# EasyEDA Pro project My_first_PCB.epro, schematic New Project

## Sheets
1 Sheet_1: Board Name: New Project; Create Date: 2025-05-11; Page Name: Sheet_1; Project Name: PCB_lllast; Schematic Name: New Project; Update Date: 2025-05-11; Add into BOM: yes; Company: Your Company; Convert to PCB: yes; Date: 2025-04-23; Draw By: telescopelight; REV: 1.0; Sheet: 1/1; spicePre: .
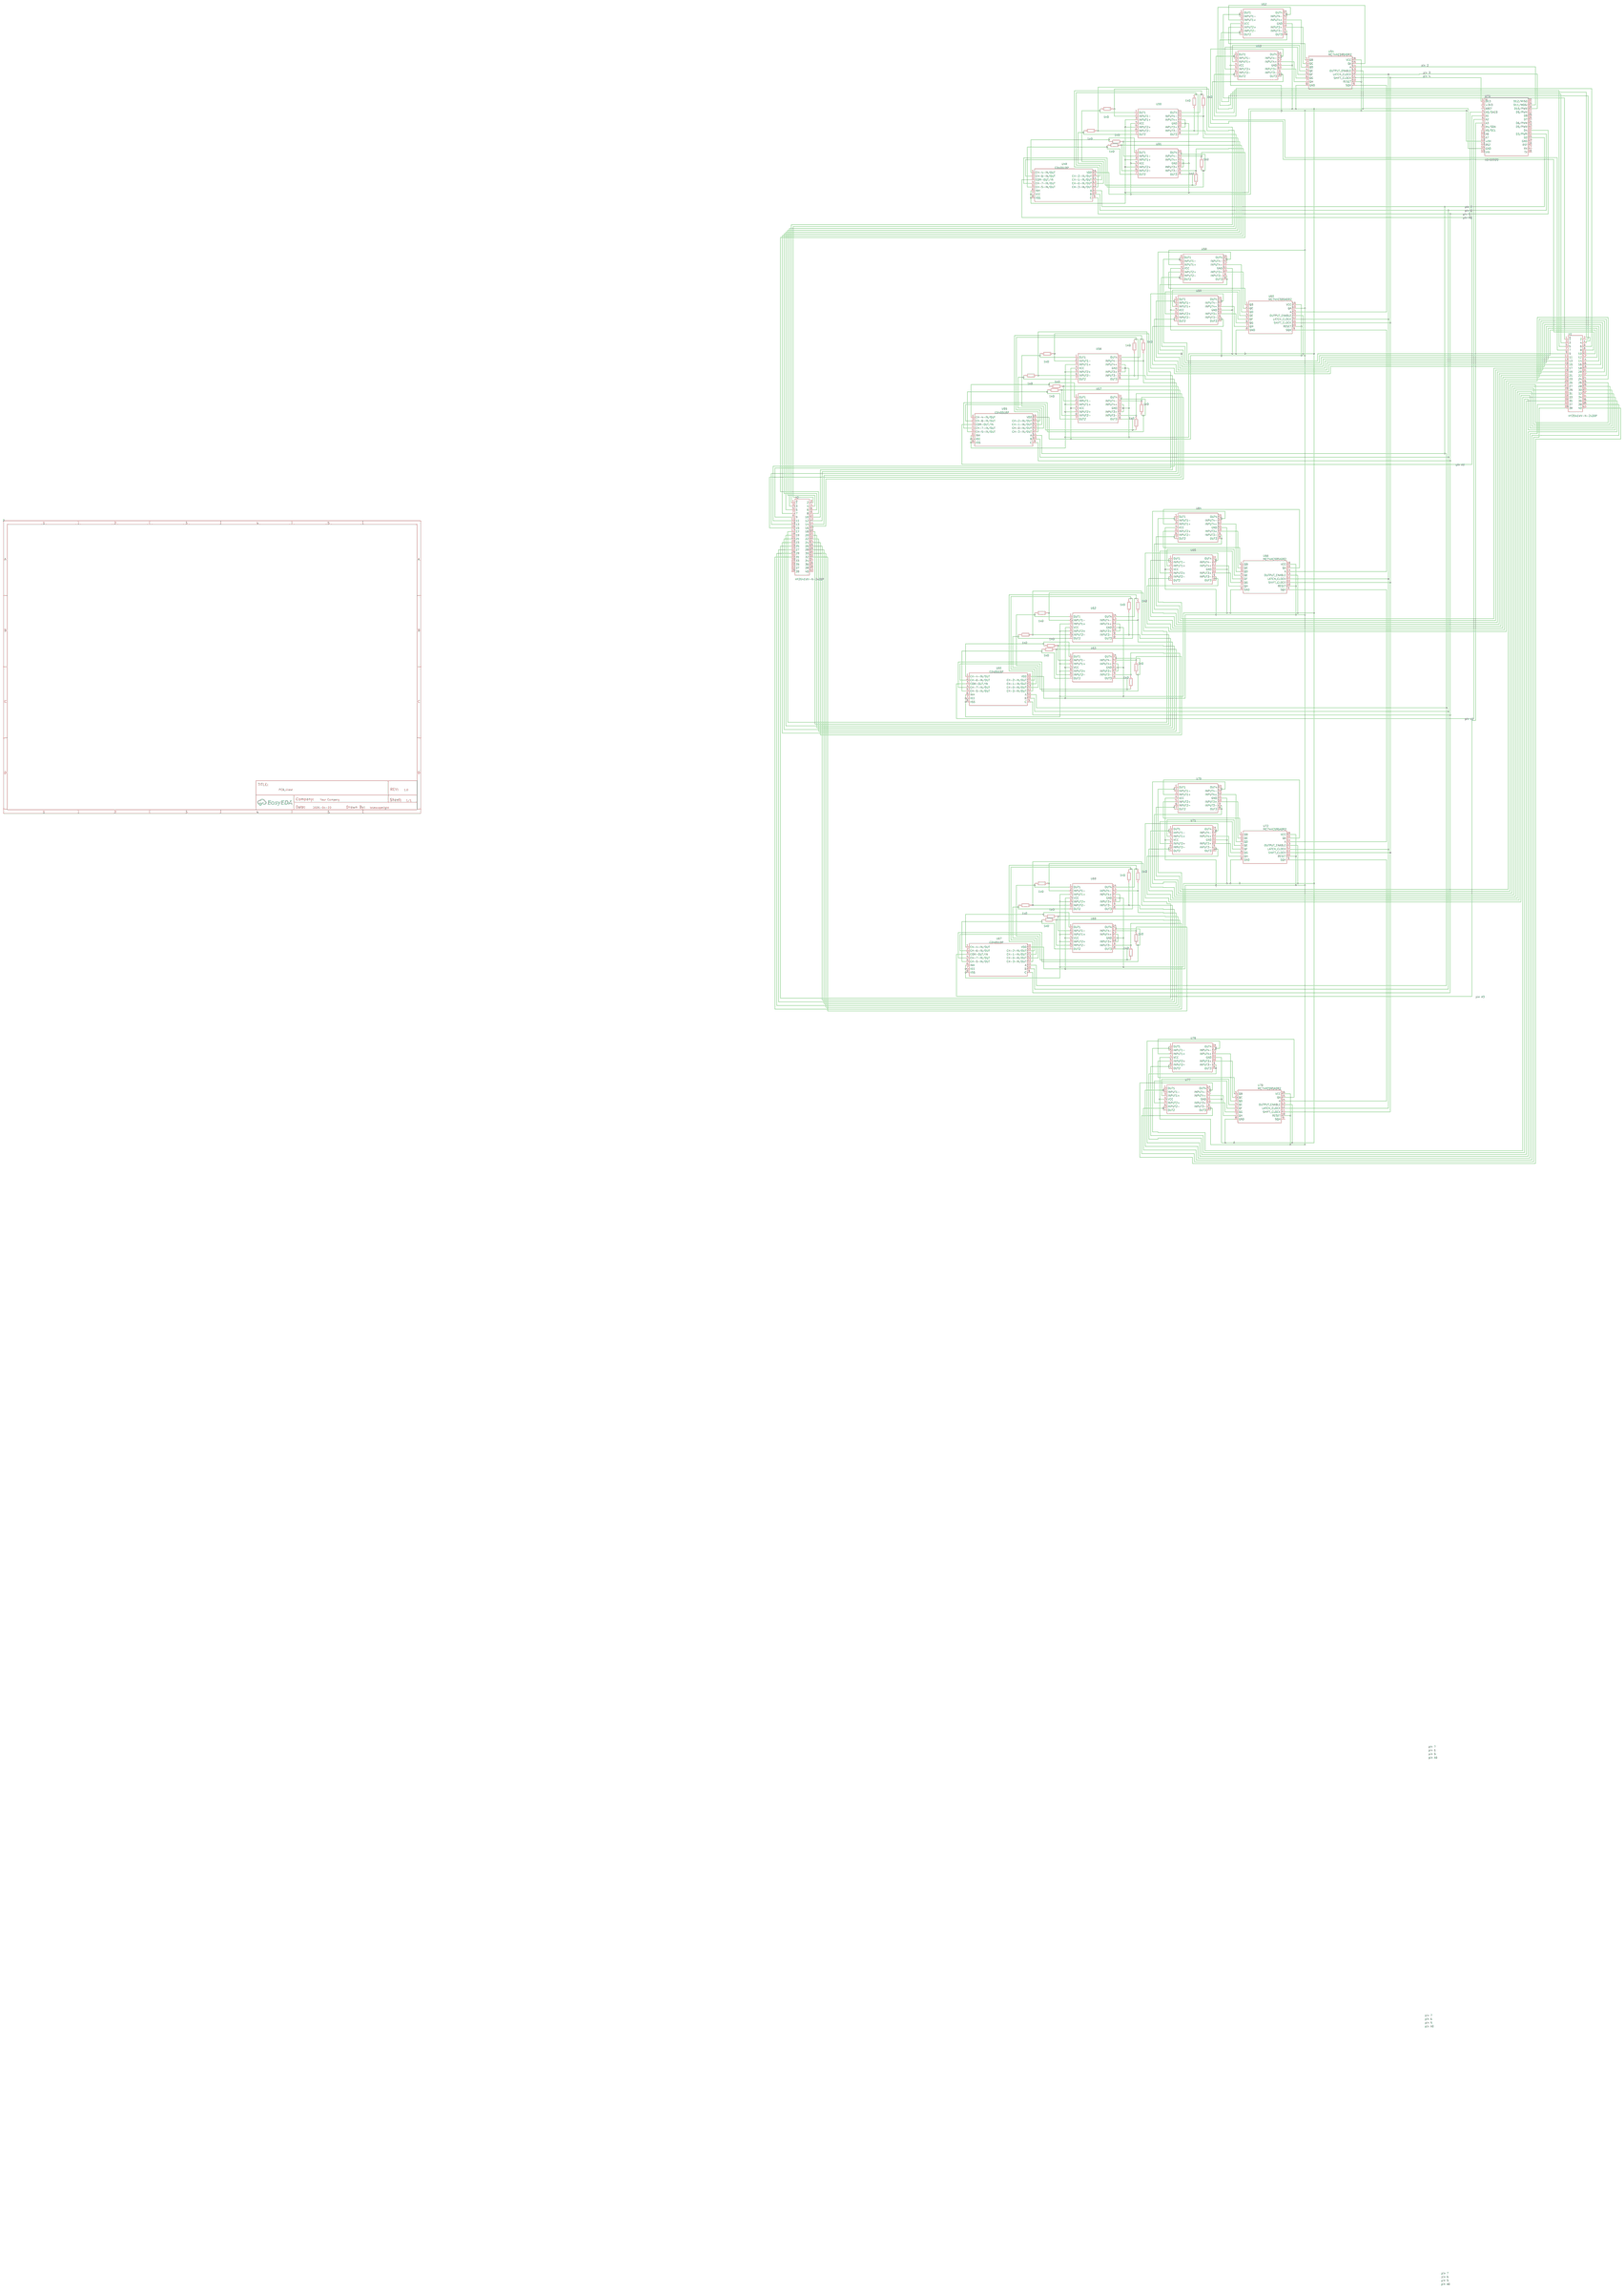
[diagram p0: Sheet_1]
2 P2: Create Date: 2025-04-23; Page Name: P1; Project Name: Project Name; Schematic Name: Schematic Name; Update Date: 2021.11.05; Company: EasyEDA.com; Page Size: A4; Version: V1.0
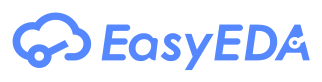
[diagram p1: P2]
3 P3: Create Date: 2025-04-23; Page Name: P1; Project Name: Project Name; Schematic Name: Schematic Name; Update Date: 2021.11.05; Company: EasyEDA.com; Page Size: A4; Version: V1.0
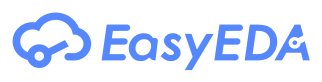
[diagram p2: P3]
4 P4: Create Date: 2025-04-23; Page Name: P1; Project Name: Project Name; Schematic Name: Schematic Name; Update Date: 2021.11.05; Company: EasyEDA.com; Page Size: A4; Version: V1.0
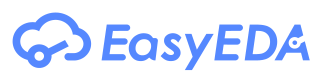
[diagram p3: P4]

## Parts
H1  HY2541WV-N-2x20P  [HDR-TH_40P-P2.54-V-F-R2-C20-S2.54_6]
H2  HY2541WV-N-2x20P  [HDR-TH_40P-P2.54-V-F-R2-C20-S2.54_6]
R65  1kΩ  [R0603]
R66  1kΩ  [R0603]
R67  1kΩ  [R0603]
R68  1kΩ  [R0603]
R69  1kΩ  [R0603]
R70  1kΩ  [R0603]
R71  1kΩ  [R0603]
R72  1kΩ  [R0603]
R73  1kΩ  [R0603]
R74  1kΩ  [R0603]
R75  1kΩ  [R0603]
R76  1kΩ  [R0603]
R77  1kΩ  [R0603]
R78  1kΩ  [R0603]
R79  1kΩ  [R0603]
R80  1kΩ  [R0603]
R81  1kΩ  [R0603]
R82  1kΩ  [R0603]
R83  1kΩ  [R0603]
R84  1kΩ  [R0603]
R85  1kΩ  [R0603]
R86  1kΩ  [R0603]
R87  1kΩ  [R0603]
R88  1kΩ  [R0603]
R89  1kΩ  [R0603]
R90  1kΩ  [R0603]
R91  1kΩ  [R0603]
R92  1kΩ  [R0603]
R93  1kΩ  [R0603]
R94  1kΩ  [R0603]
R95  1kΩ  [R0603]
R96  1kΩ  [R0603]
U49  CD4051BP  [SOIC-16_L9.9-W3.9-P1.27-LS6.0-BL]
U50  LM324N_C20616361  [DIP-14_L19.2-W6.6-P2.54-LS10.9-BL]
U51  LM324N_C20616361  [DIP-14_L19.2-W6.6-P2.54-LS10.9-BL]
U52  LM324N_C20616361  [DIP-14_L19.2-W6.6-P2.54-LS10.9-BL]
U53  LM324N_C20616361  [DIP-14_L19.2-W6.6-P2.54-LS10.9-BL]
U54  MC74HC595ADR2  [SOIC-16_L9.9-W3.9-P1.27-LS6.0-BL]
U55  CD4051BP  [SOIC-16_L9.9-W3.9-P1.27-LS6.0-BL]
U56  LM324N_C20616361  [DIP-14_L19.2-W6.6-P2.54-LS10.9-BL]
U57  LM324N_C20616361  [DIP-14_L19.2-W6.6-P2.54-LS10.9-BL]
U58  LM324N_C20616361  [DIP-14_L19.2-W6.6-P2.54-LS10.9-BL]
U59  LM324N_C20616361  [DIP-14_L19.2-W6.6-P2.54-LS10.9-BL]
U60  MC74HC595ADR2  [SOIC-16_L9.9-W3.9-P1.27-LS6.0-BL]
U61  CD4051BP  [SOIC-16_L9.9-W3.9-P1.27-LS6.0-BL]
U62  LM324N_C20616361  [DIP-14_L19.2-W6.6-P2.54-LS10.9-BL]
U63  LM324N_C20616361  [DIP-14_L19.2-W6.6-P2.54-LS10.9-BL]
U64  LM324N_C20616361  [DIP-14_L19.2-W6.6-P2.54-LS10.9-BL]
U65  LM324N_C20616361  [DIP-14_L19.2-W6.6-P2.54-LS10.9-BL]
U66  MC74HC595ADR2  [SOIC-16_L9.9-W3.9-P1.27-LS6.0-BL]
U67  CD4051BP  [SOIC-16_L9.9-W3.9-P1.27-LS6.0-BL]
U68  LM324N_C20616361  [DIP-14_L19.2-W6.6-P2.54-LS10.9-BL]
U69  LM324N_C20616361  [DIP-14_L19.2-W6.6-P2.54-LS10.9-BL]
U70  LM324N_C20616361  [DIP-14_L19.2-W6.6-P2.54-LS10.9-BL]
U71  LM324N_C20616361  [DIP-14_L19.2-W6.6-P2.54-LS10.9-BL]
U72  MC74HC595ADR2  [SOIC-16_L9.9-W3.9-P1.27-LS6.0-BL]
U76  LM324N_C20616361  [DIP-14_L19.2-W6.6-P2.54-LS10.9-BL]
U77  LM324N_C20616361  [DIP-14_L19.2-W6.6-P2.54-LS10.9-BL]
U78  MC74HC595ADR2  [SOIC-16_L9.9-W3.9-P1.27-LS6.0-BL]
U79  ABX00028  [MOD-TH_ABX00028]

## Library data of the parts
H1 H2 = HY2541WV-N-2x20P: Connector Type:Simple cow constellation Pitch:2.54mm Number of Positions or Pins:2x20P Current Rating:1A Voltage Rating (Max):- Holder Type:Direct Insert Row Spacing:2.54mm Number of Rows:2 Number of PINs Per Row:20 Operating Temperature:-55℃~+105℃ Operat; LCSC Part Name: 2.54mm 2x20P 排数:2 每排P数:20; Supplier Part: C25503130; Manufacturer: HanElectricity(瀚源); Supplier Footprint: 插件,P=2.54mm; JLCPCB Part Class: Extended Part; Datasheet: https://atta.szlcsc.com/upload/public/pdf/source/20240704/F9C642535A626EC3FAD9C1D939CDF554.pdf; Supplier: LCSC; Connector Type: Simple cow constellation; Pitch: 2.54mm; Number of Positions or Pins: 2x20P; Current Rating: 1A; Holder Type: Direct Insert; Row Spacing: 2.54mm; Number of Rows: 2; Number of PINs Per Row: 20; Operating Temperature: -55℃~+105℃
R65-R96 = FRC0603J102 TS: Type:Thick Film Resistors Resistance:1kΩ Tolerance:±5% Tolerance:±5% Power(Watts): Overload Voltage (Max): Temperature Coefficient:±100ppm/℃ Temperature Coefficient:±100ppm/℃ Operating Temperature Range:-55℃~+155℃ Operating Temperature Range:-55℃~+155℃; LCSC Part Name: 1kΩ ±5% 100mW 厚膜电阻; Supplier Part: C2907113; Manufacturer: FOJAN(富捷); Supplier Footprint: 0603; JLCPCB Part Class: Extended Part; Datasheet: https://atta.szlcsc.com/upload/public/pdf/source/20211221/925EC7D7225764EE0046F22065062C87.pdf; Supplier: LCSC; Type: Thick Film Resistors; Tolerance: ±5%; Temperature Coefficient: ±100ppm/℃; Operating Temperature Range: -55℃~+155℃
U49 U55 U61 U67 = CD4051BP: Supplier: LCSC; Supplier Part: C5274825; Manufacturer: Sungine(双竞集成); JLCPCB Part Class: Extended Part; Contributor: lcsc; spicePre: U
U50-U53 U56-U59 U62-U65 U68-U71 U76 U77 = LM324N_C20616361: Supplier: LCSC; Supplier Part: C20616361; Manufacturer: HXY MOSFET(华轩阳电子); Manufacturer Part: LM324N; JLCPCB Part Class: Extended Part; Contributor: lcsc; spicePre: U
U54 U60 U66 U72 U78 = MC74HC595ADR2: Supplier: LCSC; Supplier Part: C3304332; Manufacturer: onsemi(安森美); JLCPCB Part Class: Extended Part; Contributor: lcsc; spicePre: U
U79 = ABX00028: Supplier Part: C21303176; Manufacturer: arduino; Datasheet: https://atta.szlcsc.com/upload/public/pdf/source/20240516/DBE20BC6A27351D8B1B352A6E0678D57.pdf; Supplier: LCSC

## Nets
$1N14304: U54.14(A) U79.29(D11/MOSI)
$1N14310: U52.3(INPUT1+) U54.15(QA)
$1N14316: H1.1 U52.1(OUT1) U52.2(INPUT1-)
$1N14330: H2.8 R67.2 U51.13(INPUT4-)
$1N14338: R67.1 U49.4(CH-7-IN/OUT) U51.14(OUT4)
$1N14350: H2.4 R65.1 U50.13(INPUT4-)
$1N14355: H1.8 U53.13(INPUT4-) U53.14(OUT4)
$1N14369: H1.7 U53.8(OUT3) U53.9(INPUT3-)
$1N14384: H1.5 U53.1(OUT1) U53.2(INPUT1-)
$1N14390: H1.6 U53.6(INPUT2-) U53.7(OUT2)
$1N14396: R69.1 U49.5(CH-5-IN/OUT) U51.7(OUT2)
$1N14405: R68.1 U49.1(CH-4-IN/OUT) U51.1(OUT1)
$1N14418: R66.1 U49.2(CH-6-IN/OUT) U51.8(OUT3)
$1N14427: U49.6(INH) U49.7(VEE) U49.8(VSS) U50.3(INPUT1+) U50.5(INPUT2+) U50.10(INPUT3+) U50.11(GND) U50.12(INPUT4+) U51.3(INPUT1+) U51.5(INPUT2+) U51.10(INPUT3+) U51.11(GND) U51.12(INPUT4+) U52.11(GND) U53.11(GND) U54.8(GND) U54.13(OUTPUT ENABLE) U55.6(INH) U55.7(VEE) U55.8(VSS) U56.3(INPUT1+) U56.5(INPUT2+) U56.10(INPUT3+) U56.11(GND) U56.12(INPUT4+) U57.3(INPUT1+) U57.5(INPUT2+) U57.10(INPUT3+) U57.11(GND) U57.12(INPUT4+) U58.11(GND) U59.11(GND) U60.8(GND) U60.13(OUTPUT ENABLE) U61.6(INH) U61.7(VEE) U61.8(VSS) U62.3(INPUT1+) U62.5(INPUT2+) U62.10(INPUT3+) U62.11(GND) U62.12(INPUT4+) U63.3(INPUT1+) U63.5(INPUT2+) U63.10(INPUT3+) U63.11(GND) U63.12(INPUT4+) U64.11(GND) U65.11(GND) U66.8(GND) U66.13(OUTPUT ENABLE) U67.6(INH) U67.7(VEE) U67.8(VSS) U68.3(INPUT1+) U68.5(INPUT2+) U68.10(INPUT3+) U68.11(GND) U68.12(INPUT4+) U69.3(INPUT1+) U69.5(INPUT2+) U69.10(INPUT3+) U69.11(GND) U69.12(INPUT4+) U70.11(GND) U71.11(GND) U72.8(GND) U72.13(OUTPUT ENABLE) U76.11(GND) U77.11(GND) U78.8(GND) U78.13(OUTPUT ENABLE) U79.14(GND)
$1N14475: H2.6 R69.2 U51.6(INPUT2-)
$1N14479: U49.16(VDD) U50.4(VCC) U51.4(VCC) U52.4(VCC) U53.4(VCC) U54.10(RESET) U54.16(VCC) U55.16(VDD) U56.4(VCC) U57.4(VCC) U58.3(INPUT1+) U58.4(VCC) U59.4(VCC) U60.10(RESET) U60.15(QA) U60.16(VCC) U61.16(VDD) U62.4(VCC) U63.4(VCC) U64.4(VCC) U65.4(VCC) U66.10(RESET) U66.16(VCC) U67.16(VDD) U68.4(VCC) U69.4(VCC) U70.4(VCC) U71.4(VCC) U72.10(RESET) U72.16(VCC) U76.4(VCC) U77.4(VCC) U78.10(RESET) U78.16(VCC) U79.12(+5V)
$1N14502: R70.2 U49.15(CH-2-IN/OUT) U50.8(OUT3)
$1N14513: R65.2 U49.12(CH-3-IN/OUT) U50.14(OUT4)
$1N14524: R71.1 U49.13(CH-0-IN/OUT) U50.1(OUT1)
$1N14533: R72.1 U49.14(CH-1-IN/OUT) U50.7(OUT2)
$1N14552: U49.10(B) U55.10(B) U61.10(B) U67.10(B) U79.21(D3/PWM)
$1N14556: U49.11(A) U55.11(A) U61.11(A) U67.11(A) U79.20(D2)
$1N14560: U49.3(COM-OUT/IN) U79.4(A0/DAC0)
$1N14564: U53.10(INPUT3+) U54.6(QG)
$1N14568: U53.12(INPUT4+) U54.7(QH)
$1N14572: U53.3(INPUT1+) U54.4(QE)
$1N14578: U53.5(INPUT2+) U54.5(QF)
$1N14584: U52.10(INPUT3+) U54.2(QC)
$1N14588: U52.12(INPUT4+) U54.3(QD)
$1N14592: U52.5(INPUT2+) U54.1(QB)
$1N16074: U61.3(COM-OUT/IN) U79.6(A2)
$1N16078: R82.1 U61.2(CH-6-IN/OUT) U63.8(OUT3)
$1N16087: R83.1 U61.4(CH-7-IN/OUT) U63.14(OUT4)
$1N16099: H2.23 R82.2 U63.9(INPUT3-)
$1N16103: H2.24 R83.2 U63.13(INPUT4-)
$1N16107: H2.20 R81.1 U62.13(INPUT4-)
$1N16112: R84.1 U61.1(CH-4-IN/OUT) U63.1(OUT1)
$1N16119: H2.22 R85.2 U63.6(INPUT2-)
$1N16123: H2.21 R84.2 U63.2(INPUT1-)
$1N16127: R86.2 U61.15(CH-2-IN/OUT) U62.8(OUT3)
$1N16138: R88.1 U61.14(CH-1-IN/OUT) U62.7(OUT2)
$1N16147: R87.1 U61.13(CH-0-IN/OUT) U62.1(OUT1)
$1N16156: R85.1 U61.5(CH-5-IN/OUT) U63.7(OUT2)
$1N16165: R81.2 U61.12(CH-3-IN/OUT) U62.14(OUT4)
$1N16176: H2.18 R88.2 U62.6(INPUT2-)
$1N16182: H2.19 R86.1 U62.9(INPUT3-)
$1N16188: H1.22 U65.6(INPUT2-) U65.7(OUT2)
$1N16194: H1.24 U65.13(INPUT4-) U65.14(OUT4)
$1N16202: H1.23 U65.8(OUT3) U65.9(INPUT3-)
$1N16223: U65.5(INPUT2+) U66.5(QF)
$1N16229: U65.12(INPUT4+) U66.7(QH)
$1N16233: U65.10(INPUT3+) U66.6(QG)
$1N16237: U65.3(INPUT1+) U66.4(QE)
$1N16243: U64.10(INPUT3+) U66.2(QC)
$1N16247: U64.12(INPUT4+) U66.3(QD)
$1N16265: H1.17 U64.1(OUT1) U64.2(INPUT1-)
$1N16271: H1.18 U64.6(INPUT2-) U64.7(OUT2)
$1N16277: U64.5(INPUT2+) U66.1(QB)
$1N16282: U64.3(INPUT1+) U66.15(QA)
$1N16332: H2.16 R75.2 U57.13(INPUT4-)
$1N16336: R75.1 U55.4(CH-7-IN/OUT) U57.14(OUT4)
$1N16381: H1.11 U58.8(OUT3) U58.9(INPUT3-)
$1N16387: H1.12 U58.13(INPUT4-) U58.14(OUT4)
$1N16395: H1.13 U59.1(OUT1) U59.2(INPUT1-)
$1N16401: H1.9 U58.1(OUT1) U58.2(INPUT1-)
$1N16407: H1.10 U58.6(INPUT2-) U58.7(OUT2)
$1N16413: H1.14 U59.6(INPUT2-) U59.7(OUT2)
$1N16419: H1.15 U59.8(OUT3) U59.9(INPUT3-)
$1N16427: H1.16 U59.13(INPUT4-) U59.14(OUT4)
$1N16435: U59.5(INPUT2+) U60.5(QF)
$1N16441: U59.10(INPUT3+) U60.6(QG)
$1N16445: U59.3(INPUT1+) U60.4(QE)
$1N16451: U59.12(INPUT4+) U60.7(QH)
$1N16455: U58.5(INPUT2+) U60.1(QB)
$1N16460: U58.12(INPUT4+) U60.3(QD)
$1N16464: U58.10(INPUT3+) U60.2(QC)
$1N16468: H2.10 R80.2 U56.6(INPUT2-)
$1N16487: R76.1 U55.1(CH-4-IN/OUT) U57.1(OUT1)
$1N16494: R77.1 U55.5(CH-5-IN/OUT) U57.7(OUT2)
$1N16503: R78.2 U55.15(CH-2-IN/OUT) U56.8(OUT3)
$1N16514: H2.12 R73.1 U56.13(INPUT4-)
$1N16519: R73.2 U55.12(CH-3-IN/OUT) U56.14(OUT4)
$1N16534: H2.14 R77.2 U57.6(INPUT2-)
$1N16538: R80.1 U55.14(CH-1-IN/OUT) U56.7(OUT2)
$1N16547: R79.1 U55.13(CH-0-IN/OUT) U56.1(OUT1)
$1N16568: U55.3(COM-OUT/IN) U79.5(A1)
$1N16572: R74.1 U55.2(CH-6-IN/OUT) U57.8(OUT3)
$1N21935: U70.3(INPUT1+) U72.15(QA)
$1N21941: H1.28 U70.13(INPUT4-) U70.14(OUT4)
$1N22016: U70.12(INPUT4+) U72.3(QD)
$1N22174: U76.3(INPUT1+) U78.15(QA)
$1N22192: H1.39 U77.8(OUT3) U77.9(INPUT3-)
$1N22200: H1.40 U77.13(INPUT4-) U77.14(OUT4)
$1N22248: U77.3(INPUT1+) U78.4(QE)
$1N22254: U77.5(INPUT2+) U78.5(QF)
$1N22260: H1.38 U77.6(INPUT2-) U77.7(OUT2)
$1N22272: H1.36 U76.13(INPUT4-) U76.14(OUT4)
$1N22280: H1.35 U76.8(OUT3) U76.9(INPUT3-)
$1N22286: H1.34 U76.6(INPUT2-) U76.7(OUT2)
$1N22292: H1.33 U76.1(OUT1) U76.2(INPUT1-)
$1N22298: R91.1 U67.4(CH-7-IN/OUT) U69.14(OUT4)
$1N22310: H2.31 R90.2 U69.9(INPUT3-)
$1N22314: H2.32 R91.2 U69.13(INPUT4-)
$1N22318: R90.1 U67.2(CH-6-IN/OUT) U69.8(OUT3)
$1N22327: U76.12(INPUT4+) U78.3(QD)
$1N22331: U77.12(INPUT4+) U78.7(QH)
$1N22335: U77.10(INPUT3+) U78.6(QG)
$1N22339: U76.10(INPUT3+) U78.2(QC)
$1N22343: U76.5(INPUT2+) U78.1(QB)
$1N22348: H2.28 R89.1 U68.13(INPUT4-)
$1N22353: H2.30 R93.2 U69.6(INPUT2-)
$1N22357: R93.1 U67.5(CH-5-IN/OUT) U69.7(OUT2)
$1N22366: R94.2 U67.15(CH-2-IN/OUT) U68.8(OUT3)
$1N22377: R96.1 U67.14(CH-1-IN/OUT) U68.7(OUT2)
$1N22386: R92.1 U67.1(CH-4-IN/OUT) U69.1(OUT1)
$1N22397: R89.2 U67.12(CH-3-IN/OUT) U68.14(OUT4)
$1N22408: R95.1 U67.13(CH-0-IN/OUT) U68.1(OUT1)
$1N22417: U49.9(C) U55.9(C) U61.9(C) U67.9(C) U79.22(D4)
$1N22429: U67.3(COM-OUT/IN) U79.7(A3)
$1N22441: H1.32 U71.13(INPUT4-) U71.14(OUT4)
$1N22449: H2.26 R96.2 U68.6(INPUT2-)
$1N22455: H2.25 R95.2 U68.2(INPUT1-)
$1N22462: H2.27 R94.1 U68.9(INPUT3-)
$1N22468: U71.5(INPUT2+) U72.5(QF)
$1N22474: U71.10(INPUT3+) U72.6(QG)
$1N22478: U71.3(INPUT1+) U72.4(QE)
$1N22484: U71.12(INPUT4+) U72.7(QH)
$1N22488: U70.10(INPUT3+) U72.2(QC)
$1N22492: H1.30 U71.6(INPUT2-) U71.7(OUT2)
$1N22498: U70.5(INPUT2+) U72.1(QB)
$1N22503: H1.26 U70.6(INPUT2-) U70.7(OUT2)
$1N22509: H1.27 U70.8(OUT3) U70.9(INPUT3-)
$1N22515: H1.29 U71.1(OUT1) U71.2(INPUT1-)
$1N28467: U54.12(LATCH CLOCK) U60.12(LATCH CLOCK) U66.12(LATCH CLOCK) U78.12(LATCH CLOCK) U79.28(D10/PWM)
$1N28524: U54.11(SHIFT CLOCK) U60.11(SHIFT CLOCK) U66.11(SHIFT CLOCK) U72.11(SHIFT CLOCK) U78.11(SHIFT CLOCK) U79.1(D13)
$1N28552: U54.9(SQH) U60.14(A)
$1N28558: U60.9(SQH) U66.14(A)
$1N28575: U66.9(SQH) U72.14(A)
$1N28629: U72.9(SQH) U78.14(A)
$1N44787: H1.3 U52.8(OUT3) U52.9(INPUT3-)
$1N44861: H1.4 U52.13(INPUT4-) U52.14(OUT4)
$1N44872: H1.2 U52.6(INPUT2-) U52.7(OUT2)
$1N45077: H2.2 R72.2 U50.6(INPUT2-)
$1N46362: H1.20 U64.13(INPUT4-) U64.14(OUT4)
$1N46373: H1.19 U64.8(OUT3) U64.9(INPUT3-)
$1N46433: H1.21 U65.1(OUT1) U65.2(INPUT1-)
$1N46695: H1.25 U70.1(OUT1) U70.2(INPUT1-)
$1N46902: H1.31 U71.8(OUT3) U71.9(INPUT3-)
$1N46913: H2.17 R87.2 U62.2(INPUT1-)
$1N47117: H1.37 U77.1(OUT1) U77.2(INPUT1-)
$1N47895: H2.29 R92.2 U69.2(INPUT1-)
$1N48377: H2.13 R76.2 U57.2(INPUT1-)
$1N48455: H2.11 R78.1 U56.9(INPUT3-)
$1N48524: H2.9 R79.2 U56.2(INPUT1-)
$1N48581: H2.7 R66.2 U51.9(INPUT3-)
$1N48626: H2.5 R68.2 U51.2(INPUT1-)
$1N48735: H2.3 R70.1 U50.9(INPUT3-)
$1N48746: H2.1 R71.2 U50.2(INPUT1-)
$1N48752: H2.15 R74.2 U57.9(INPUT3-)

Not connected (* = marked no-connect by the designer): H2 33 34 35 36 37 38 39 40; U72 12(LATCH CLOCK); U78 9(SQH); U79 2(+3V3) 3(AREF) 8(A4/SDA) 9(A5/SCL) 10(A6) 11(A7) 13(RST) 15(VIN) 16(TX) 17(RX) 18(RST) 19(GND) 23(D5/PWM) 24(D6/PWM) 25(D7) 26(D8) 27(D9/PWM) 30(D12/MISO)

## Notes on the sheets
sheet 1
- pin 2
- pin 3
- pin 4
- pin 7
- pin 6
- pin 5
- pin A0
- pin A1
- pin A2
- pin A3
- pin 7
- pin 6
- pin 5
- pin A0
- pin 7
- pin 6
- pin 5
- pin A0
- pin 7
- pin 6
- pin 5
- pin A0
